# Altium schematic sheet MTP10.SchDoc
size A4; Organization: Altium Limited; Address1: L3, 12a Rodborough Rd; Address2: Frenchs Forest; Address3: NSW; Address4: Australia 2086
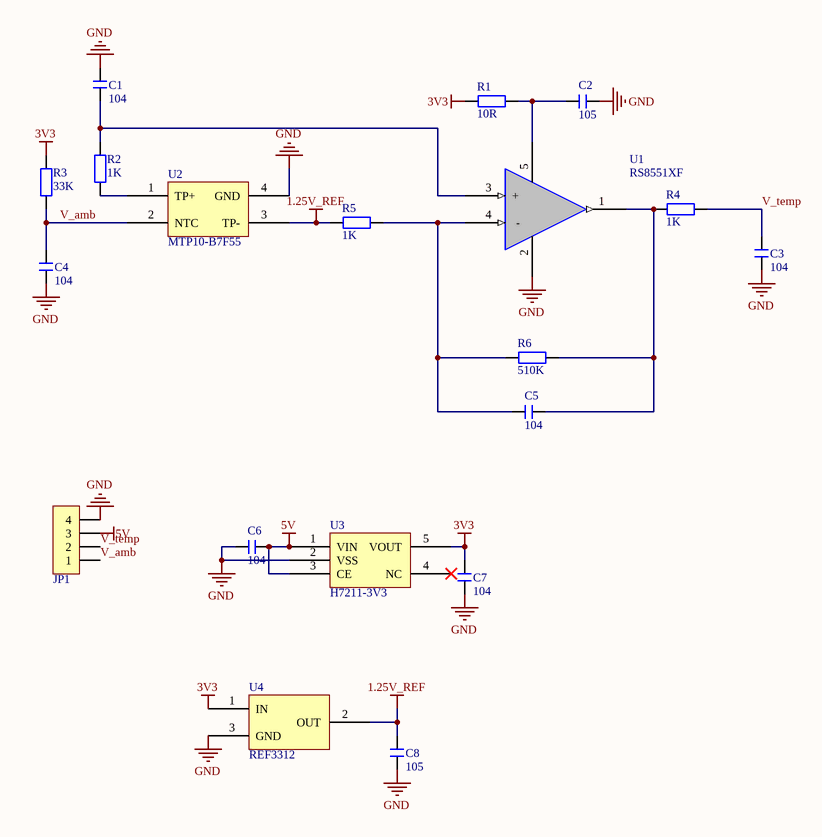
[diagram p0: MTP10.SchDoc]

## Parts
C1  104  [C 0603_L]
C2  105  [C 0603_L]
C3  104  [C 0603_L]
C4  104  [C 0603_L]
C5  104  [C 0603_L]
C6  104  [C 0603_L]
C7  104  [C 0603_L]
C8  105  [C 0603_L]
JP1  HDR-1X4  [HDR2.54-LI-4P]  (value not drawn)
R1  10R  [R 0603_L]
R2  1K  [R 0603_L]
R3  33K  [R 0603_L]
R4  1K  [R 0603_L]
R5  1K  [R 0603_L]
R6  510K  [R 0603_L]
U1  RS8551XF  [SOT23-5M]
U2  MTP10-B7F55  [MTP-10B]
U3  H7211-3V3  [SOT23-5]
U4  REF3312  [SOT23-3L]

## Nets
1.25V_REF: C8.2 R5.2 U2.3(TP-) U4.2(OUT)
3V3: C7.2 R1.2 R3.2 U3.5(VOUT) U4.1(IN)
5V: C6.1 JP1.3 U3.1(VIN) U3.3(CE)
GND: C1.1 C2.2 C3.1 C4.1 C6.2 C7.1 C8.1 JP1.4 U1.2(GND) U2.4(GND) U3.2(VSS) U4.3(GND)
V_amb: C4.2 JP1.1 R3.1 U2.2(NTC)
V_temp: C3.2 JP1.2 R4.1
NetC1_2: C1.2 R2.2 U1.3(+)
NetC2_1: C2.1 R1.1 U1.5(VDD)
NetC5_1: C5.1 R5.1 R6.2 U1.4(－)
NetC5_2: C5.2 R4.2 R6.1 U1.1(OUT)
NetR2_1: R2.1 U2.1(TP+)

Not connected (* = marked no-connect by the designer): U3 4(NC)*

## Notes on the sheet
- Title
- Size:
- Date:
- A4
- Number:
- Time:
- Revision:
- Sheet
- of
- File:

## Library data of the parts
C1-C8 = C: 无极性贴片电容; 版权归属: 源创客; BOM名称: 无极性贴片电容; 学习资源: www.ooocke.com
JP1 = Header 4: 4P接插件; 版权归属: 源创客; BOM名称: 4P接插件; 学习资源: www.ooocke.com
R1-R6 = R: 贴片电阻; 版权归属: 源创客; BOM名称: 贴片电阻; 学习资源: www.ooocke.com
U1 = RS8551XF: 仪表放大器
U2 = MTP10-B7F55: MEMS 热电堆芯片
U3 = H7211: 低噪声LDO
U4 = REF33XX: 电压基准